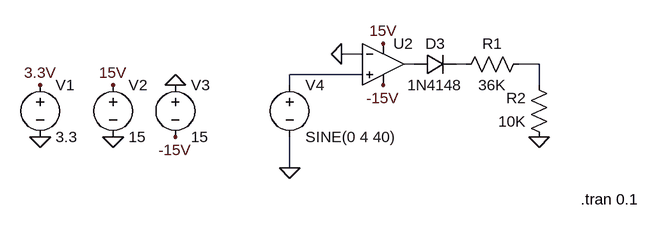
[diagram p0: schematic zcd-sim.asc]
zcd-sim.asc, the LTspice schematic file:
Version 4
SHEET 1 1000 680
WIRE 336 304 304 304
WIRE 416 320 400 320
WIRE 496 320 480 320
WIRE 608 320 576 320
WIRE 336 336 224 336
WIRE 224 352 224 336
WIRE 608 352 608 320
WIRE 224 480 224 432
FLAG 608 432 0
FLAG -48 432 0
FLAG -160 432 0
FLAG 48 352 0
FLAG -160 352 3.3V
FLAG -48 352 15V
FLAG 368 288 15V
FLAG 48 432 -15V
FLAG 368 352 -15V
FLAG 304 304 0
FLAG 224 480 0
SYMBOL res 592 304 R90
WINDOW 0 0 56 VBottom 2
WINDOW 3 32 56 VTop 2
SYMATTR InstName R1
SYMATTR Value 36K
SYMBOL res 624 448 R180
WINDOW 0 36 76 Left 2
WINDOW 3 36 40 Left 2
SYMATTR InstName R2
SYMATTR Value 10K
SYMBOL voltage -160 336 R0
SYMATTR InstName V1
SYMATTR Value 3.3
SYMBOL voltage -48 336 R0
SYMATTR InstName V2
SYMATTR Value 15
SYMBOL voltage 48 336 R0
SYMATTR InstName V3
SYMATTR Value 15
SYMBOL voltage 224 336 R0
SYMATTR InstName V4
SYMATTR Value SINE(0 4 40)
SYMBOL OpAmps/UniversalOpamp2 368 320 R0
SYMATTR InstName U2
SYMBOL diode 416 336 R270
WINDOW 0 32 32 VTop 2
WINDOW 3 0 32 VBottom 2
SYMATTR InstName D3
SYMATTR Value 1N4148
TEXT 672 528 Left 2 !.tran 0.1

The netlist it stands for:
* zcd-sim.asc
R1 N003 N002 36K
R2 0 N003 10K
V1 3.3V 0 3.3
V2 15V 0 15
V3 0 -15V 15
V4 N004 0 SINE(0 4 40)
XU2 N004 0 15V -15V N001 level.2 Avol=1Meg GBW=10Meg Slew=10Meg ilimit=25m rail=0 Vos=0 phimargin=45 en=0 enk=0 in=0 ink=0 Rin=500Meg  ; pins IN+ IN- V+ V- OUT
D3 N001 N002 1N4148
.model D D
.lib standard.dio
.tran 0.1
.lib UniversalOpamps2.sub
.backanno
.end